# Altium project v7-9BProto-motor.PrjPcb
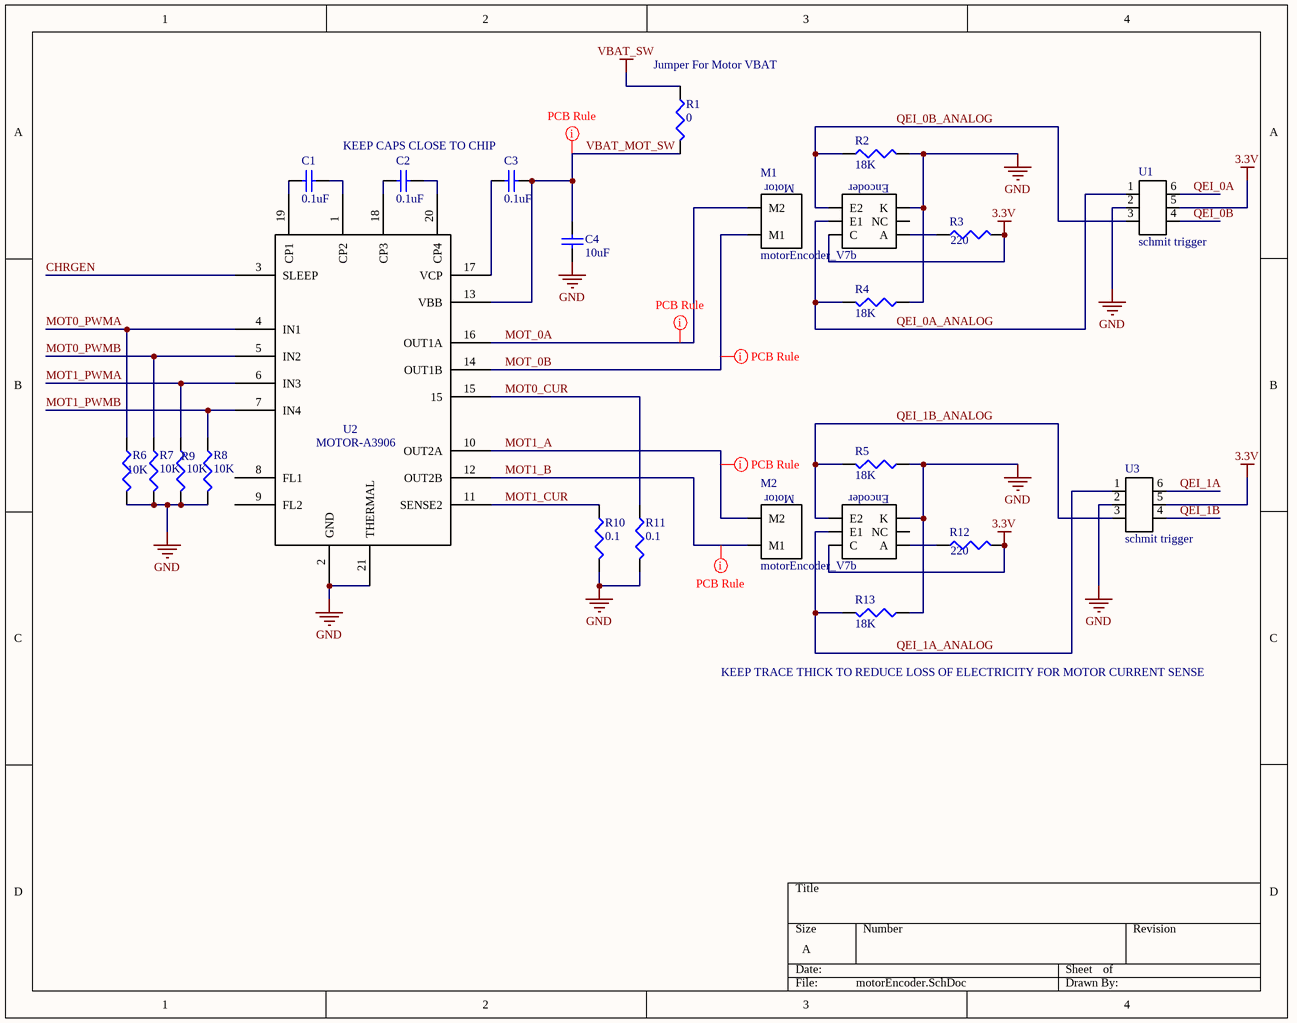
[diagram p0: motorEncoder.SchDoc]
6 sheets, 113 parts. Net scope: global (net labels, ports and power ports of the same name join across sheets).
Board file: v7-9BProto-motorPCB.PcbDoc
Sheets:
  motorEncoder.SchDoc
  LineCliffSensors.SchDoc
  SoundChip.SchDoc
  BumpSensors.SchDoc
  GyroAccelHeaders.SchDoc
  power.SchDoc

## Sheet motorEncoder.SchDoc
size A

### Parts
C1  value 0.1uF  [CAPC1005L]  (hidden comment: Cap Semi)
C2  value 0.1uF  [CAPC1005L]  (hidden comment: Cap Semi)
C3  value 0.1uF  [CAPC1005L]  (hidden comment: Cap Semi)
C4  value 10uF  [CAPC1608L]  (hidden comment: Cap Semi)
M1  motorEncoder_V7b  [motorEncoder_V7b]
M2  motorEncoder_V7b  [motorEncoder_V7b]
R1  value 0  [RESC3225L]  (hidden comment: Res3)
R2  value 18K  [RESC1608L]
R3  value 220  [RESC1608L]
R4  value 18K  [RESC1608L]
R5  value 18K  [RESC1608L]
R6  value 10K  [RESC1608L]  (hidden comment: Res3)
R7  value 10K  [RESC1608L]  (hidden comment: Res3)
R8  value 10K  [RESC1608L]  (hidden comment: Res3)
R9  value 10K  [RESC1608L]  (hidden comment: Res3)
R10  value 0.1  [RESC1608L]  (hidden comment: Res3)
R11  value 0.1  [RESC1608L]  (hidden comment: Res3)
R12  value 220  [RESC1608L]
R13  value 18K  [RESC1608L]
U1  schmit trigger  [DCK(R-PDSO-C6)]
U2  MOTOR-A3906  [QFN-20]
U3  schmit trigger  [DCK(R-PDSO-C6)]

### Nets
3.3V: M1.C M2.C R3.2 R12.2 U1.5 U3.5
GND: C4.1 M1.K M2.K R2.2 R4.1 R5.1 R6.2 R7.2 R8.2 R9.2 R10.2 R11.2 R13.1 U1.2 U2.2(GND) U2.21(THERMAL) U3.2
VBAT_SW: R1.1
CHRGEN: U2.3(SLEEP)
MOT0_CUR: R11.1 U2.15
MOT0_PWMA: R6.1 U2.4(IN1)
MOT0_PWMB: R7.1 U2.5(IN2)
MOT1_A: M2.M2 U2.10(OUT2A)
MOT1_B: M2.M1 U2.12(OUT2B)
MOT1_CUR: R10.1 U2.11(SENSE2)
MOT1_PWMA: R9.1 U2.6(IN3)
MOT1_PWMB: R8.1 U2.7(IN4)
MOT_0A: M1.M2 U2.16(OUT1A)
MOT_0B: M1.M1 U2.14(OUT1B)
QEI_0A: U1.6
QEI_0A_ANALOG: M1.E1 R4.2 U1.1
QEI_0B: U1.4
QEI_0B_ANALOG: M1.E2 R2.1 U1.3
QEI_1A: U3.6
QEI_1A_ANALOG: M2.E1 R13.2 U3.1
QEI_1B: U3.4
QEI_1B_ANALOG: M2.E2 R5.2 U3.3
VBAT_MOT_SW: C3.1 C4.2 R1.2 U2.13(VBB)
NetC1_1: C1.1 U2.19(CP1)
NetC1_2: C1.2 U2.1(CP2)
NetC2_1: C2.1 U2.18(CP3)
NetC2_2: C2.2 U2.20(CP4)
NetC3_2: C3.2 U2.17(VCP)
NetM1_A: M1.A R3.1
NetM2_A: M2.A R12.1

Not connected (* = marked no-connect by the designer): M1 NC; M2 NC; U2 8(FL1) 9(FL2)

### Layout directives
rule Width Constraint [Pref Width = 20mil    Min Width = 10mil    Max Width = 25mil]: MOT1_A, MOT1_B, MOT_0A, MOT_0B, VBAT_MOT_SW

### Notes on the sheet
- (near R1) Jumper For Motor VBAT
- KEEP CAPS CLOSE TO CHIP
- KEEP TRACE THICK TO REDUCE LOSS OF ELECTRICITY FOR MOTOR CURRENT SENSE
- (in symbol motorEncoder_V7b) Motor; Encoder

### Library data of the parts
C1-C4 = Cap Semi: Capacitor (Semiconductor SIM Model); Published: 8-Jun-2000; LatestRevisionDate: 29-May-2009; LatestRevisionNote: IPC-7351 Footprint Added.; PackageReference: C1206; Publisher: Altium Limited; PackageDescription: Chip Capacitor
R1-R13 = Res3: Resistor; Published: 8-Jun-2000; LatestRevisionDate: 29-May-2009; LatestRevisionNote: IPC-7351 Footprint Added.; PackageReference: J1-0603; Publisher: Altium Limited; PackageDescription: Chip Resistor

## Sheet LineCliffSensors.SchDoc
size A
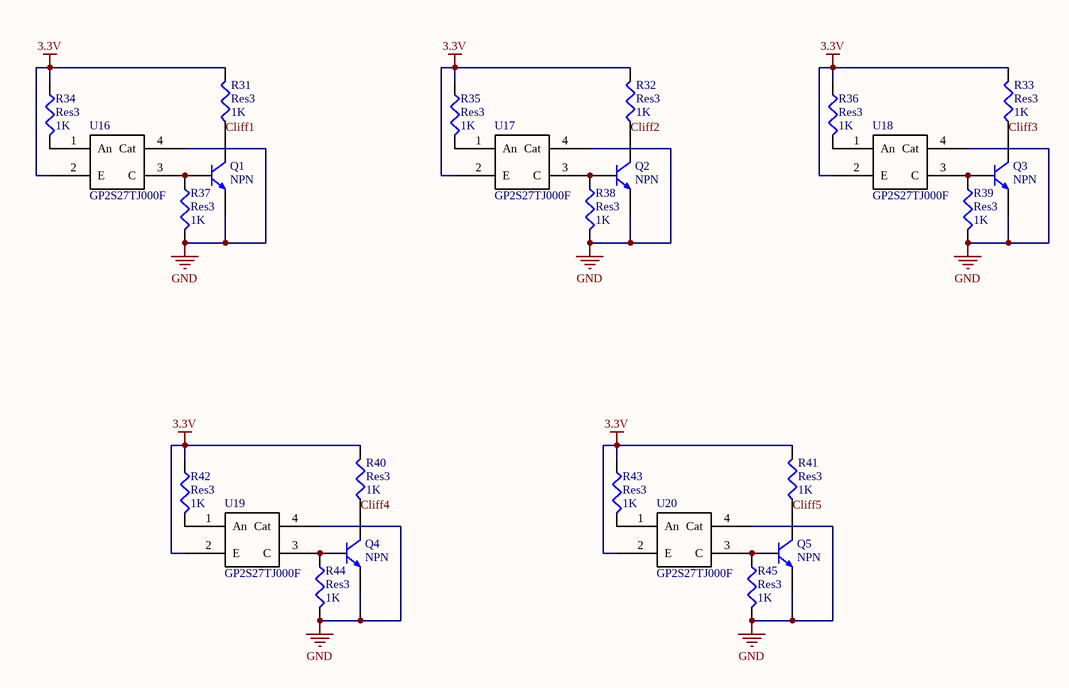
[diagram p1: LineCliffSensors.SchDoc]

### Parts
Q1  NPN  [SOT-23]
Q2  NPN  [SOT-23]
Q3  NPN  [SOT-23]
Q4  NPN  [SOT-23]
Q5  NPN  [SOT-23]
R31  Res3  value 1K  [RESC1608L]
R32  Res3  value 1K  [RESC1608L]
R33  Res3  value 1K  [RESC1608L]
R34  Res3  value 1K  [RESC1608L]
R35  Res3  value 1K  [RESC1608L]
R36  Res3  value 1K  [RESC1608L]
R37  Res3  value 1K  [RESC1608L]
R38  Res3  value 1K  [RESC1608L]
R39  Res3  value 1K  [RESC1608L]
R40  Res3  value 1K  [RESC1608L]
R41  Res3  value 1K  [RESC1608L]
R42  Res3  value 1K  [RESC1608L]
R43  Res3  value 1K  [RESC1608L]
R44  Res3  value 1K  [RESC1608L]
R45  Res3  value 1K  [RESC1608L]
U16  GP2S27TJ000F  [GP2S27J0000F]
U17  GP2S27TJ000F  [GP2S27J0000F]
U18  GP2S27TJ000F  [GP2S27J0000F]
U19  GP2S27TJ000F  [GP2S27J0000F]
U20  GP2S27TJ000F  [GP2S27J0000F]

### Nets
3.3V: R31.2 R32.2 R33.2 R34.1 R35.1 R36.1 R40.2 R41.2 R42.1 R43.1 U16.2(E) U17.2(E) U18.2(E) U19.2(E) U20.2(E)
GND: Q1.2(E) Q2.2(E) Q3.2(E) Q4.2(E) Q5.2(E) R37.2 R38.2 R39.2 R44.2 R45.2 U16.4(Cat) U17.4(Cat) U18.4(Cat) U19.4(Cat) U20.4(Cat)
Cliff1: Q1.3(C) R31.1
Cliff2: Q2.3(C) R32.1
Cliff3: Q3.3(C) R33.1
Cliff4: Q4.3(C) R40.1
Cliff5: Q5.3(C) R41.1
NetQ1_1: Q1.1(B) R37.1 U16.3(C)
NetQ2_1: Q2.1(B) R38.1 U17.3(C)
NetQ3_1: Q3.1(B) R39.1 U18.3(C)
NetQ4_1: Q4.1(B) R44.1 U19.3(C)
NetQ5_1: Q5.1(B) R45.1 U20.3(C)
NetR34_2: R34.2 U16.1(An)
NetR35_2: R35.2 U17.1(An)
NetR36_2: R36.2 U18.1(An)
NetR42_2: R42.2 U19.1(An)
NetR43_2: R43.2 U20.1(An)

### Library data of the parts
R31-R45 = Res3: Resistor; Published: 8-Jun-2000; LatestRevisionDate: 29-May-2009; LatestRevisionNote: IPC-7351 Footprint Added.; PackageReference: J1-0603; Publisher: Altium Limited; PackageDescription: Chip Resistor

## Sheet SoundChip.SchDoc
size A
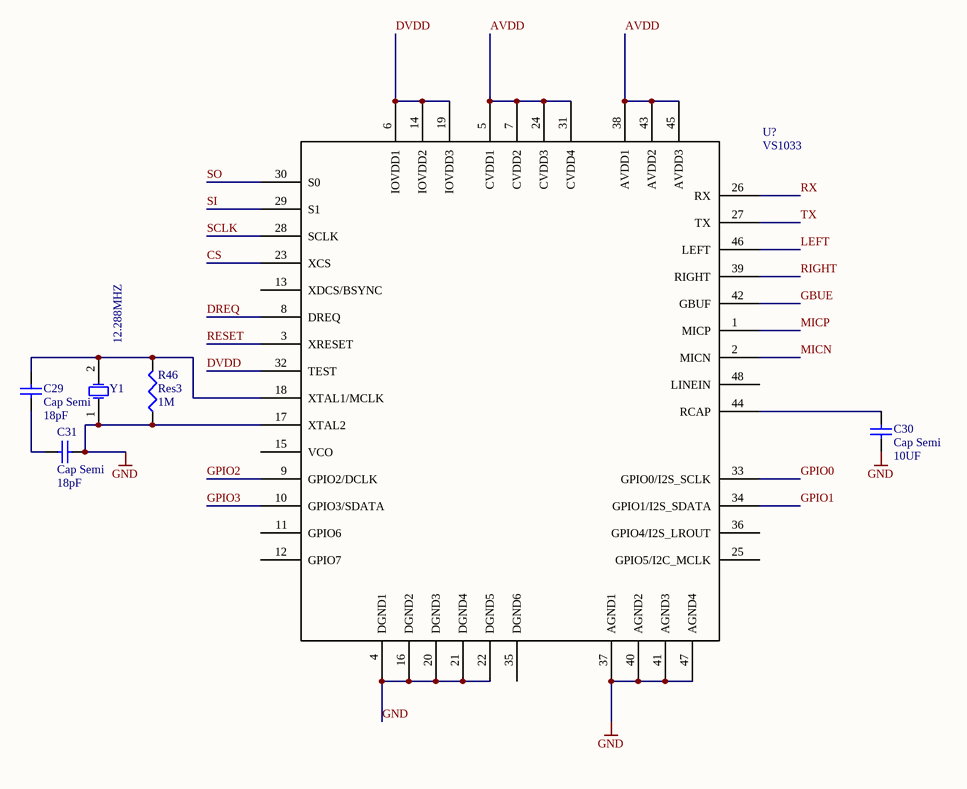
[diagram p2: SoundChip.SchDoc]

### Parts
C29  Cap Semi  value 18pF  [CAPC3216L]
C30  Cap Semi  value 10UF  [CAPC3216L]
C31  Cap Semi  value 18pF  [CAPC3216L]
R46  Res3  value 1M  [RESC1608L]
U?  VS1033  [LQFP-48]
Y1  12.288MHZ  [BCY-W2/D3.1]

### Nets
GND: C30.1 C31.1 R46.1 U?.4(DGND1) U?.16(DGND2) U?.17(XTAL2) U?.20(DGND3) U?.21(DGND4) U?.22(DGND5) U?.37(AGND1) U?.40(AGND2) U?.41(AGND3) U?.47(AGND4) Y1.1(OSC1)
AVDD: U?.5(CVDD1) U?.7(CVDD2) U?.24(CVDD3) U?.31(CVDD4) U?.38(AVDD1) U?.43(AVDD2) U?.45(AVDD3)
CS: U?.23(XCS)
DREQ: U?.8(DREQ)
DVDD: U?.6(IOVDD1) U?.14(IOVDD2) U?.19(IOVDD3) U?.32(TEST)
GBUE: U?.42(GBUF)
GPIO0: U?.33(GPIO0/I2S_SCLK)
GPIO1: U?.34(GPIO1/I2S_SDATA)
GPIO2: U?.9(GPIO2/DCLK)
GPIO3: U?.10(GPIO3/SDATA)
LEFT: U?.46(LEFT)
MICN: U?.2(MICN)
MICP: U?.1(MICP)
RESET: U?.3(XRESET)
RIGHT: U?.39(RIGHT)
RX: U?.26(RX)
SCLK: U?.28(SCLK)
SI: U?.29(S1)
SO: U?.30(S0)
TX: U?.27(TX)
NetC29_1: C29.1 C31.2
NetC29_2: C29.2 R46.2 U?.18(XTAL1/MCLK) Y1.2(OSC2)
NetC30_2: C30.2 U?.44(RCAP)

Not connected (* = marked no-connect by the designer): U? 11(GPIO6) 12(GPIO7) 13(XDCS/BSYNC) 15(VCO) 25(GPIO5/I2C_MCLK) 35(DGND6) 36(GPIO4/I2S_LROUT) 48(LINEIN)

### Library data of the parts
C29-C31 = Cap Semi: Capacitor (Semiconductor SIM Model); Published: 8-Jun-2000; LatestRevisionDate: 29-May-2009; LatestRevisionNote: IPC-7351 Footprint Added.; PackageReference: C1206; Publisher: Altium Limited; PackageDescription: Chip Capacitor
R46 = Res3: Resistor; Published: 8-Jun-2000; LatestRevisionDate: 29-May-2009; LatestRevisionNote: IPC-7351 Footprint Added.; PackageReference: J1-0603; Publisher: Altium Limited; PackageDescription: Chip Resistor
Y1 = XTAL: Crystal Oscillator; Published: 8-Jun-2000; LatestRevisionDate: 17-Jul-2002; LatestRevisionNote: Re-released for DXP Platform.; PackageReference: R38; Publisher: Altium Limited

## Sheet BumpSensors.SchDoc
size A
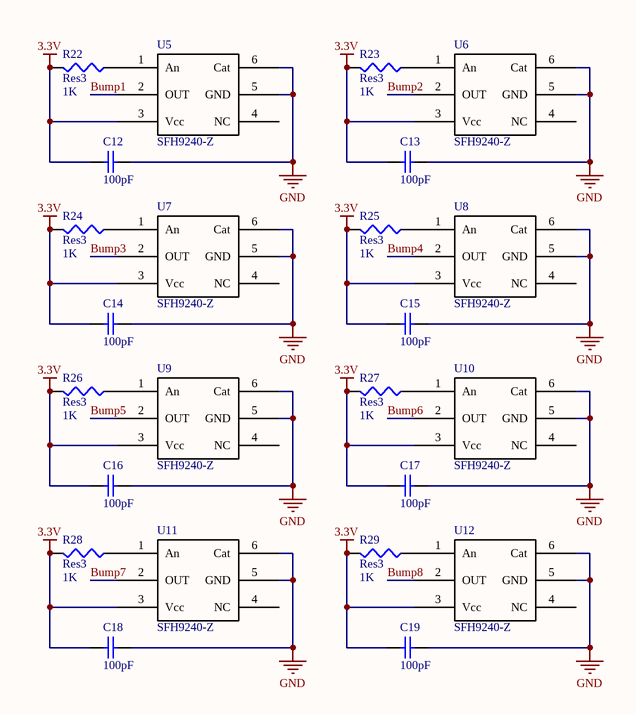
[diagram p3: BumpSensors.SchDoc]

### Parts
C12  value 100pF  [CAPC1005L]  (hidden comment: Cap Semi)
C13  value 100pF  [CAPC1005L]  (hidden comment: Cap Semi)
C14  value 100pF  [CAPC1005L]  (hidden comment: Cap Semi)
C15  value 100pF  [CAPC1005L]  (hidden comment: Cap Semi)
C16  value 100pF  [CAPC1005L]  (hidden comment: Cap Semi)
C17  value 100pF  [CAPC1005L]  (hidden comment: Cap Semi)
C18  value 100pF  [CAPC1005L]  (hidden comment: Cap Semi)
C19  value 100pF  [CAPC1005L]  (hidden comment: Cap Semi)
R22  Res3  value 1K  [RESC1608L]
R23  Res3  value 1K  [RESC1608L]
R24  Res3  value 1K  [RESC1608L]
R25  Res3  value 1K  [RESC1608L]
R26  Res3  value 1K  [RESC1608L]
R27  Res3  value 1K  [RESC1608L]
R28  Res3  value 1K  [RESC1608L]
R29  Res3  value 1K  [RESC1608L]
U5  SFH9240-Z  [SFH9240-Z]
U6  SFH9240-Z  [SFH9240-Z]
U7  SFH9240-Z  [SFH9240-Z]
U8  SFH9240-Z  [SFH9240-Z]
U9  SFH9240-Z  [SFH9240-Z]
U10  SFH9240-Z  [SFH9240-Z]
U11  SFH9240-Z  [SFH9240-Z]
U12  SFH9240-Z  [SFH9240-Z]

### Nets
3.3V: C12.2 C13.2 C14.2 C15.2 C16.2 C17.2 C18.2 C19.2 R22.2 R23.2 R24.2 R25.2 R26.2 R27.2 R28.2 R29.2 U5.3(Vcc) U6.3(Vcc) U7.3(Vcc) U8.3(Vcc) U9.3(Vcc) U10.3(Vcc) U11.3(Vcc) U12.3(Vcc)
GND: C12.1 C13.1 C14.1 C15.1 C16.1 C17.1 C18.1 C19.1 U5.5(GND) U5.6(Cat) U6.5(GND) U6.6(Cat) U7.5(GND) U7.6(Cat) U8.5(GND) U8.6(Cat) U9.5(GND) U9.6(Cat) U10.5(GND) U10.6(Cat) U11.5(GND) U11.6(Cat) U12.5(GND) U12.6(Cat)
Bump1: U5.2(OUT)
Bump2: U6.2(OUT)
Bump3: U7.2(OUT)
Bump4: U8.2(OUT)
Bump5: U9.2(OUT)
Bump6: U10.2(OUT)
Bump7: U11.2(OUT)
Bump8: U12.2(OUT)
NetR22_1: R22.1 U5.1(An)
NetR23_1: R23.1 U6.1(An)
NetR24_1: R24.1 U7.1(An)
NetR25_1: R25.1 U8.1(An)
NetR26_1: R26.1 U9.1(An)
NetR27_1: R27.1 U10.1(An)
NetR28_1: R28.1 U11.1(An)
NetR29_1: R29.1 U12.1(An)

Not connected (* = marked no-connect by the designer): U5 4(NC); U6 4(NC); U7 4(NC); U8 4(NC); U9 4(NC); U10 4(NC); U11 4(NC); U12 4(NC)

### Library data of the parts
C12-C19 = Cap Semi: Capacitor (Semiconductor SIM Model); Published: 8-Jun-2000; LatestRevisionDate: 29-May-2009; LatestRevisionNote: IPC-7351 Footprint Added.; PackageReference: C1206; Publisher: Altium Limited; PackageDescription: Chip Capacitor
R22-R29 = Res3: Resistor; Published: 8-Jun-2000; LatestRevisionDate: 29-May-2009; LatestRevisionNote: IPC-7351 Footprint Added.; PackageReference: J1-0603; Publisher: Altium Limited; PackageDescription: Chip Resistor

## Sheet GyroAccelHeaders.SchDoc
size A
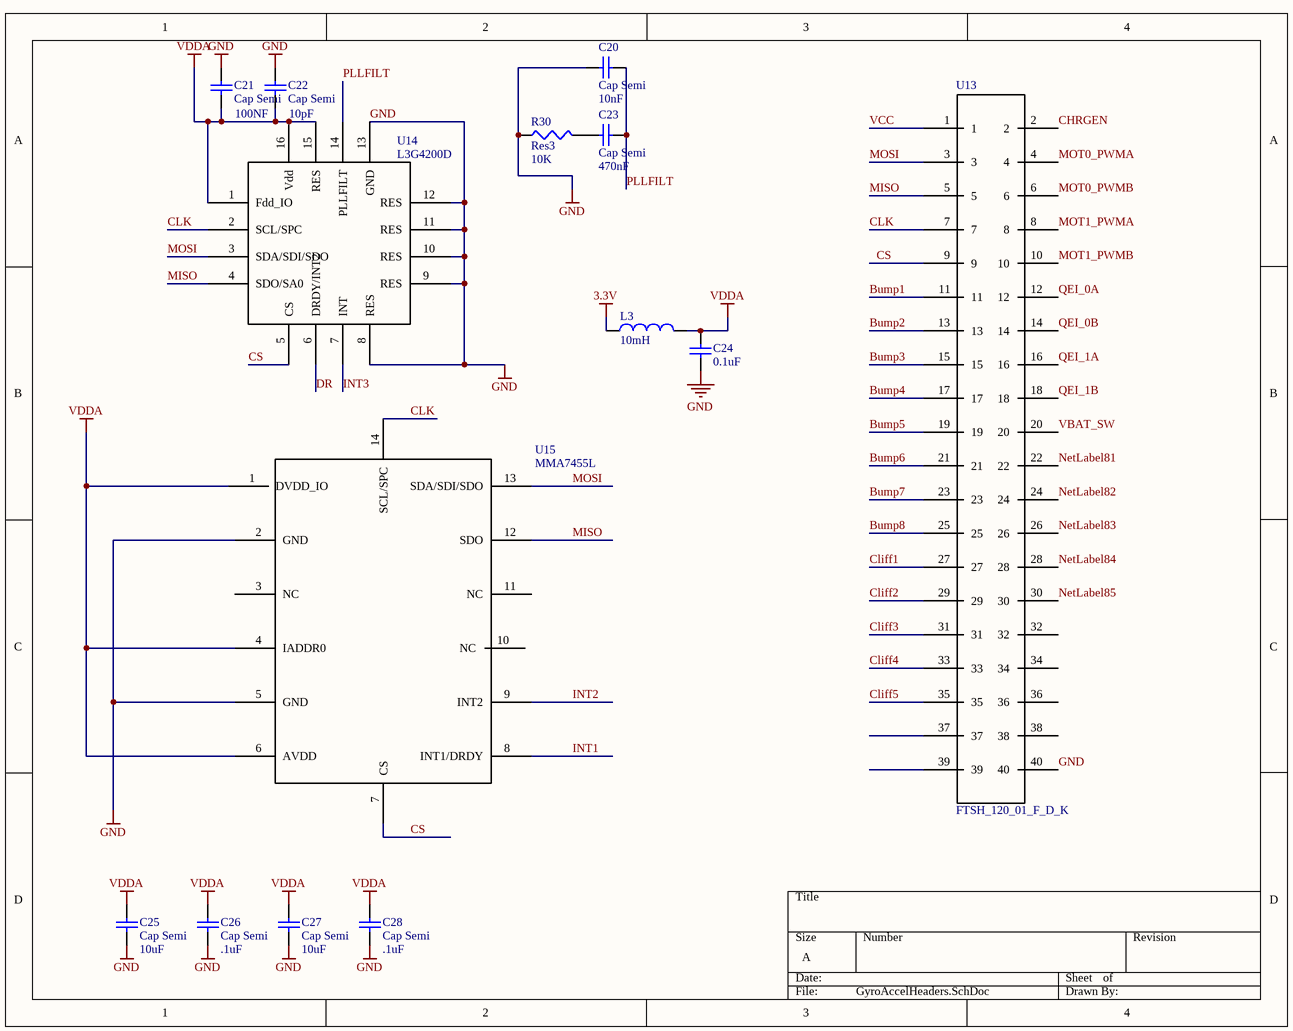
[diagram p4: GyroAccelHeaders.SchDoc]

### Parts
C20  Cap Semi  value 10nF  [CAPC3216L]
C21  Cap Semi  value 100NF  [CAPC3216L]
C22  Cap Semi  value 10pF  [CAPC3216L]
C23  Cap Semi  value 470nF  [CAPC3216L]
C24  value 0.1uF  [CAPC1005L]  (hidden comment: Cap Semi)
C25  Cap Semi  value 10uF  [CAPC3216L]
C26  Cap Semi  value .1uF  [CAPC3216L]
C27  Cap Semi  value 10uF  [CAPC3216L]
C28  Cap Semi  value .1uF  [CAPC3216L]
L3  value 10mH  [INDC2012L]  (hidden comment: Inductor)
R30  Res3  value 10K  [RESC1608L]
U13  FTSH_120_01_F_D_K  [FTSH_120_01_F_D_K]
U14  L3G4200D  [L3G4200D]
U15  MMA7455L  [MMA7455L]

### Nets
3.3V: L3.2
GND: C20.1 C21.2 C22.2 C24.1 C25.1 C26.1 C27.1 C28.1 R30.1 U13.40 U14.8(RES) U14.9(RES) U14.10(RES) U14.11(RES) U14.12(RES) U14.13(GND) U15.2(GND) U15.5(GND)
VBAT_SW: U13.20
VDDA: C21.1 C22.1 C24.2 C25.2 C26.2 C27.2 C28.2 L3.1 U14.1(Fdd_IO) U14.15(RES) U14.16(Vdd) U15.1(DVDD_IO) U15.4(IADDR0) U15.6(AVDD)
Bump1: U13.11
Bump2: U13.13
Bump3: U13.15
Bump4: U13.17
Bump5: U13.19
Bump6: U13.21
Bump7: U13.23
Bump8: U13.25
CHRGEN: U13.2
Cliff1: U13.27
Cliff2: U13.29
Cliff3: U13.31
Cliff4: U13.33
Cliff5: U13.35
CLK: U13.7 U14.2(SCL/SPC) U15.14(SCL/SPC)
CS: U13.9 U14.5(CS) U15.7(CS)
DR: U14.6(DRDY/INT2)
INT1: U15.8(INT1/DRDY)
INT2: U15.9(INT2)
INT3: U14.7(INT)
MISO: U13.5 U14.4(SDO/SA0) U15.12(SDO)
MOSI: U13.3 U14.3(SDA/SDI/SDO) U15.13(SDA/SDI/SDO)
MOT0_PWMA: U13.4
MOT0_PWMB: U13.6
MOT1_PWMA: U13.8
MOT1_PWMB: U13.10
NetLabel81: U13.22
NetLabel82: U13.24
NetLabel83: U13.26
NetLabel84: U13.28
NetLabel85: U13.30
PLLFILT: C20.2 C23.2 U14.14(PLLFILT)
QEI_0A: U13.12
QEI_0B: U13.14
QEI_1A: U13.16
QEI_1B: U13.18
VCC: U13.1
NetC23_1: C23.1 R30.2

Not connected (* = marked no-connect by the designer): U13 32 34 36 37 38 39; U15 3(NC) 10(NC) 11(NC)

### Library data of the parts
C20-C28 = Cap Semi: Capacitor (Semiconductor SIM Model); Published: 8-Jun-2000; LatestRevisionDate: 29-May-2009; LatestRevisionNote: IPC-7351 Footprint Added.; PackageReference: C1206; Publisher: Altium Limited; PackageDescription: Chip Capacitor
L3 = Inductor: Code_IEC: 1005; Published: 8-Jun-2000; LatestRevisionDate: 29-May-2009; LatestRevisionNote: IPC-7351 Footprint Added.; PackageReference: 0402-A; Publisher: Altium Limited; PackageDescription: Chip Inductor; Code_JEITA: 0402
R30 = Res3: Resistor; Published: 8-Jun-2000; LatestRevisionDate: 29-May-2009; LatestRevisionNote: IPC-7351 Footprint Added.; PackageReference: J1-0603; Publisher: Altium Limited; PackageDescription: Chip Resistor
U13 = FTSH_120_01_F_D_K: Header, 2X20, 50mil, IDC
U14 = L3G4200D: 3axis gyroscope, SPI
U15 = MMA7455L: 3axis accelerometer

## Sheet power.SchDoc
size A
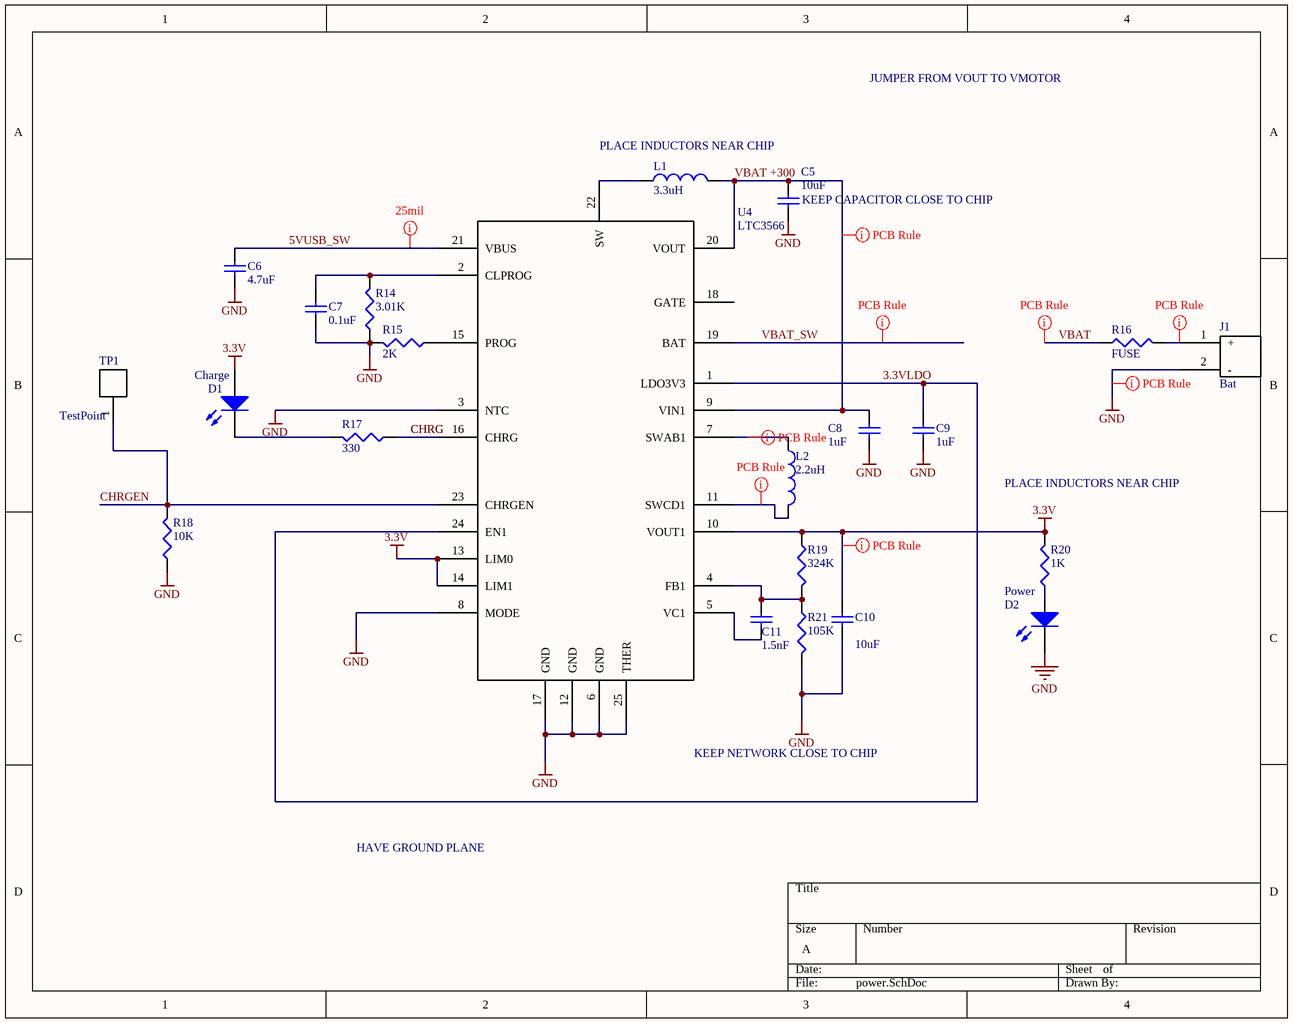
[diagram p5: power.SchDoc]

### Parts
C5  value 10uF  [CAPC1608L]  (hidden comment: Cap)
C6  value 4.7uF  [CAPC1608L]  (hidden comment: Cap)
C7  value 0.1uF  [CAPC1005L]  (hidden comment: Cap)
C8  value 1uF  [CAPC1608L]  (hidden comment: Cap)
C9  value 1uF  [CAPC1608L]  (hidden comment: Cap)
C10  value 10uF  [CAPC1608L]  (hidden comment: Cap)
C11  value 1.5nF  [CAPC1005L]  (hidden comment: Cap)
D1  Charge  [INDC2012L]
D2  Power  [INDC2012L]
J1  Bat  [BatteryConnJST]
L1  3.3uH  [Inductor-Power]
L2  2.2uH  [Inductor-Power]
R14  value 3.01K  [RESC1608L]  (hidden comment: Res3)
R15  value 2K  [RESC1608L]  (hidden comment: Res3)
R16  value FUSE  [RESC3225L]  (hidden comment: Res3)
R17  value 330  [RESC1608L]  (hidden comment: Res3)
R18  value 10K  [RESC1608L]  (hidden comment: Res3)
R19  value 324K  [RESC1608L]  (hidden comment: Res3)
R20  value 1K  [RESC1608L]  (hidden comment: Res3)
R21  value 105K  [RESC1608L]  (hidden comment: Res3)
TP1  TestPoint  [TestPoint]
U4  LTC3566  [QFN-24]

### Nets
3.3V: C10.2 D1.1(A) R19.1 R20.2 U4.10(VOUT1) U4.13(LIM0) U4.14(LIM1)
GND: C5.1 C6.1 C7.1 C8.2 C9.2 C10.1 D2.2(K) J1.2(-) R14.1 R15.2 R18.1 R21.2 U4.3(NTC) U4.6(GND) U4.8(MODE) U4.12(GND) U4.17(GND) U4.25(THER)
VBAT_SW: U4.19(BAT)
3.3VLDO: C9.1 U4.1(LDO3V3) U4.24(EN1)
5VUSB_SW: C6.2 U4.21(VBUS)
CHRG: R17.1 U4.16(CHRG)
CHRGEN: R18.2 TP1.1 U4.23(CHRGEN)
VBAT: R16.1
VBAT +300: C5.2 C8.1 L1.2 U4.9(VIN1) U4.20(VOUT)
NetC7_2: C7.2 R14.2 U4.2(CLPROG)
NetC11_1: C11.1 R19.2 R21.1 U4.4(FB1)
NetC11_2: C11.2 U4.5(VC1)
NetD1_2: D1.2(K) R17.2
NetD2_1: D2.1(A) R20.1
NetJ1_1: J1.1(+) R16.2
NetL1_1: L1.1 U4.22(SW)
NetL2_1: L2.1 U4.7(SWAB1)
NetL2_2: L2.2 U4.11(SWCD1)
NetR15_1: R15.1 U4.15(PROG)

Not connected (* = marked no-connect by the designer): U4 18(GATE)

### Layout directives
rule Width Constraint [Pref Width = 25mil    Min Width = 10mil    Max Width = 25mil]: 5VUSB_SW, GND, NetJ1_1, NetL2_1, NetL2_2, VBAT, VBAT +300
rule Width Constraint [Pref Width = 25mil    Min Width = 10mil    Max Width = 100mil]: 3.3V
rule Width Constraint [Pref Width = 25mil    Min Width = 10mil    Max Width = 50mil]: VBAT_SW

### Notes on the sheet
- JUMPER FROM VOUT TO VMOTOR
- (near L1) PLACE INDUCTORS NEAR CHIP
- (near C5) KEEP CAPACITOR CLOSE TO CHIP
- CHRG
- PLACE INDUCTORS NEAR CHIP
- KEEP NETWORK CLOSE TO CHIP
- HAVE GROUND PLANE

### Library data of the parts
C5-C11 = Cap: Capacitor; Published: 8-Jun-2000; LatestRevisionDate: 17-Jul-2002; LatestRevisionNote: Re-released for DXP Platform.; PackageReference: RAD-0.3; Publisher: Altium Limited
D1 D2 = LED2: Typical RED, GREEN, YELLOW, AMBER GaAs LED; Published: 8-Jun-2000; LatestRevisionDate: 17-Jul-2002; LatestRevisionNote: Re-released for DXP Platform.; PackageVersion: Feb-2002; PackageReference: 3.2X1.6X1.1; Publisher: Altium Limited
J1 = BatteryConnJST
L1 L2 = Inductor
R14-R21 = Res3: Resistor; Published: 8-Jun-2000; LatestRevisionDate: 29-May-2009; LatestRevisionNote: IPC-7351 Footprint Added.; PackageReference: J1-0603; Publisher: Altium Limited; PackageDescription: Chip Resistor

## Nets that join several sheets
3.3V: motorEncoder (6 pins), LineCliffSensors (15 pins), BumpSensors (24 pins), GyroAccelHeaders (L3.2), power (7 pins)
GND: motorEncoder (17 pins), LineCliffSensors (15 pins), SoundChip (14 pins), BumpSensors (24 pins), GyroAccelHeaders (18 pins), power (18 pins)
VBAT_SW: motorEncoder (R1.1), GyroAccelHeaders (U13.20), power (U4.19)
Bump1: BumpSensors (U5.2), GyroAccelHeaders (U13.11)
Bump2: BumpSensors (U6.2), GyroAccelHeaders (U13.13)
Bump3: BumpSensors (U7.2), GyroAccelHeaders (U13.15)
Bump4: BumpSensors (U8.2), GyroAccelHeaders (U13.17)
Bump5: BumpSensors (U9.2), GyroAccelHeaders (U13.19)
Bump6: BumpSensors (U10.2), GyroAccelHeaders (U13.21)
Bump7: BumpSensors (U11.2), GyroAccelHeaders (U13.23)
Bump8: BumpSensors (U12.2), GyroAccelHeaders (U13.25)
CHRGEN: motorEncoder (U2.3), GyroAccelHeaders (U13.2), power (R18.2 TP1.1 U4.23)
Cliff1: LineCliffSensors (Q1.3 R31.1), GyroAccelHeaders (U13.27)
Cliff2: LineCliffSensors (Q2.3 R32.1), GyroAccelHeaders (U13.29)
Cliff3: LineCliffSensors (Q3.3 R33.1), GyroAccelHeaders (U13.31)
Cliff4: LineCliffSensors (Q4.3 R40.1), GyroAccelHeaders (U13.33)
Cliff5: LineCliffSensors (Q5.3 R41.1), GyroAccelHeaders (U13.35)
CS: SoundChip (U?.23), GyroAccelHeaders (U13.9 U14.5 U15.7)
MOT0_PWMA: motorEncoder (R6.1 U2.4), GyroAccelHeaders (U13.4)
MOT0_PWMB: motorEncoder (R7.1 U2.5), GyroAccelHeaders (U13.6)
MOT1_PWMA: motorEncoder (R9.1 U2.6), GyroAccelHeaders (U13.8)
MOT1_PWMB: motorEncoder (R8.1 U2.7), GyroAccelHeaders (U13.10)
QEI_0A: motorEncoder (U1.6), GyroAccelHeaders (U13.12)
QEI_0B: motorEncoder (U1.4), GyroAccelHeaders (U13.14)
QEI_1A: motorEncoder (U3.6), GyroAccelHeaders (U13.16)
QEI_1B: motorEncoder (U3.4), GyroAccelHeaders (U13.18)